# EAGLE design motor_ctrl_pw_v3 (EAGLE 6.5.0)
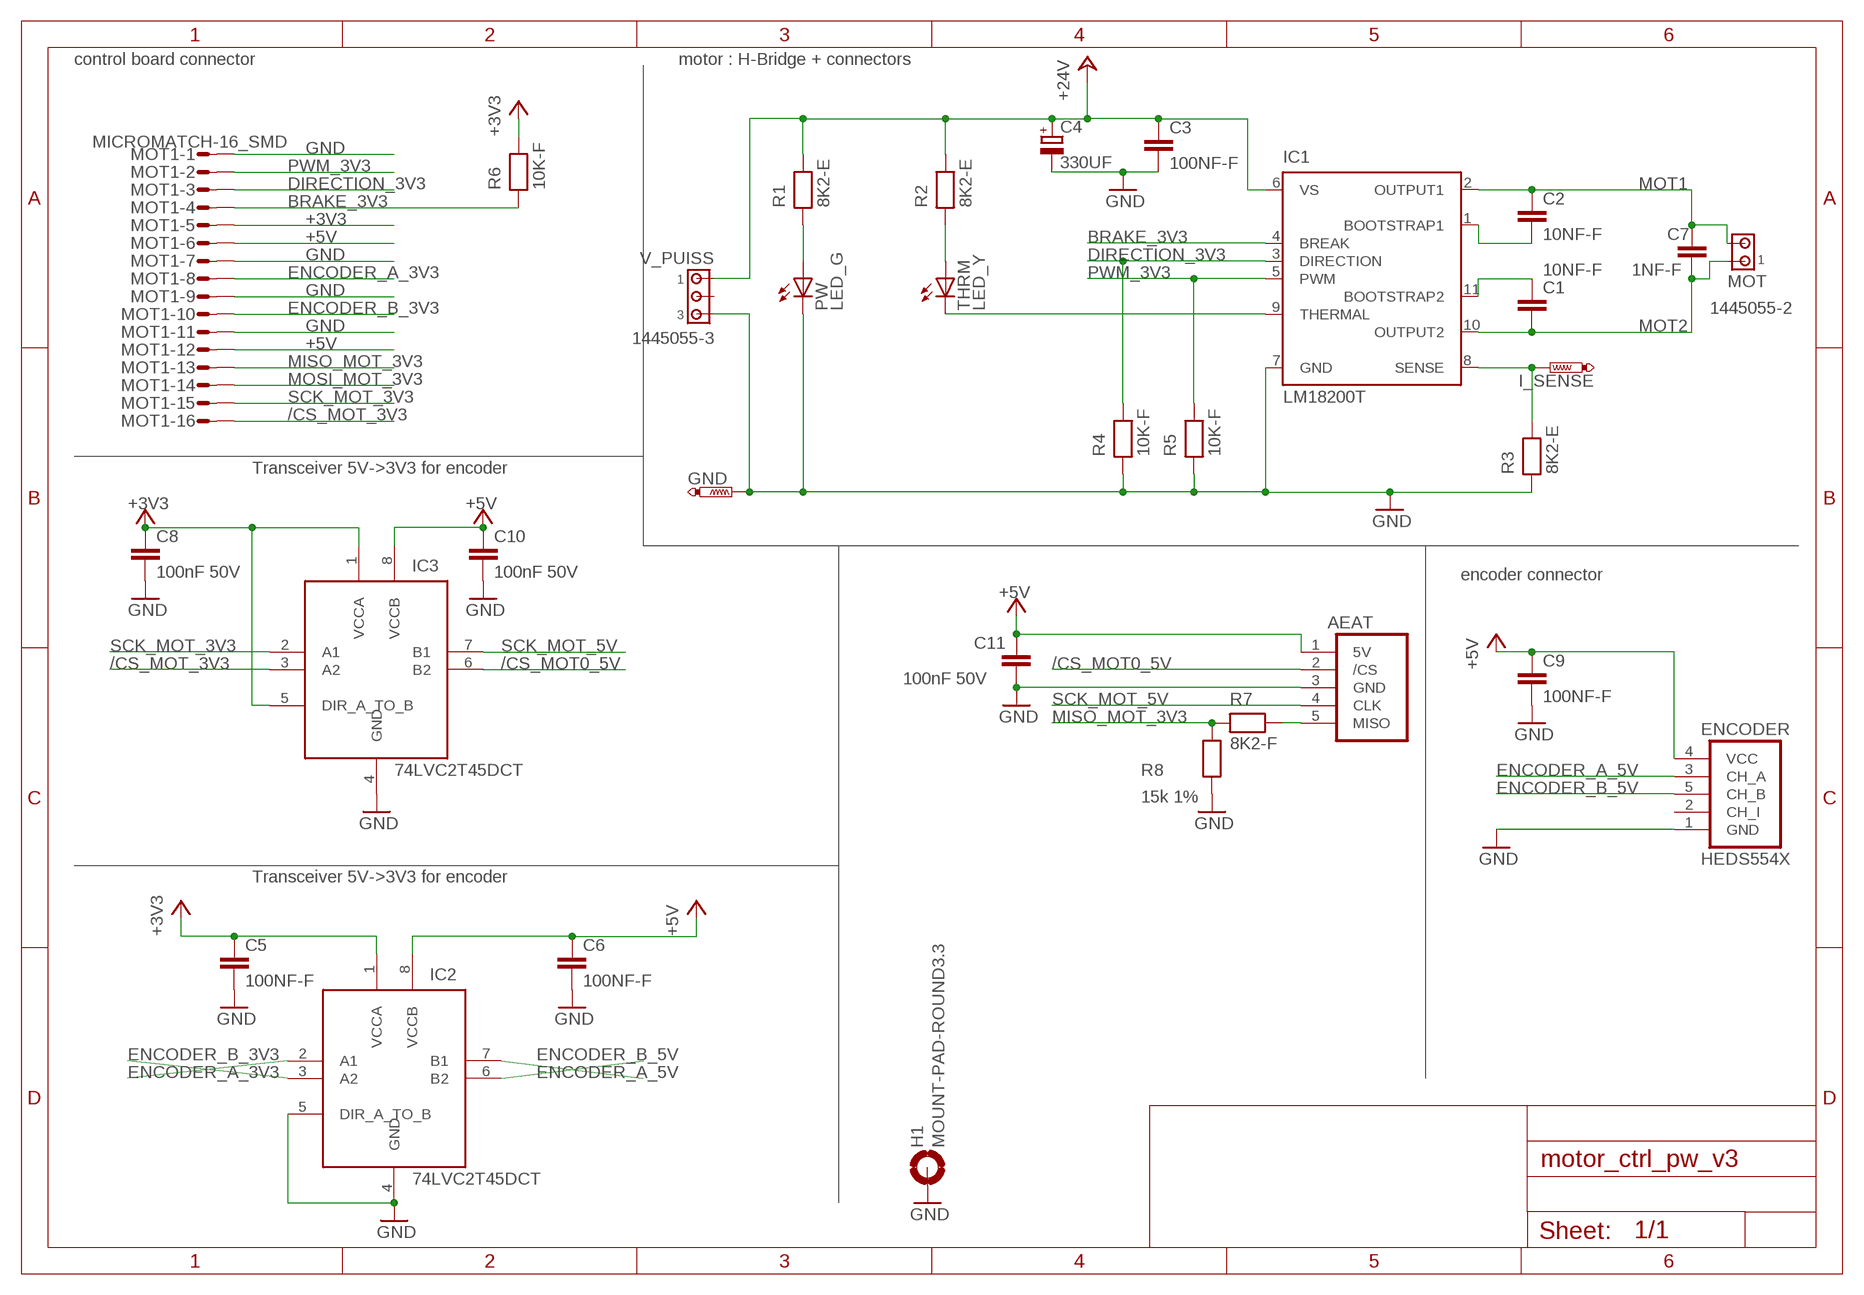
[diagram p0: schematic, sheet 1]

## Parts
AEAT  AEAT-601X  [53047-05]
C1  10NF-F  [C0603]
C2  10NF-F  [C0603]
C3  100NF-F  [C0603]
C4  330UF  [PANASONIC_G]
C5  100NF-F  [C0603]
C6  100NF-F  [C0603]
C7  1NF-F  [C0603]
C8  100nF 50V  100NF-F  [C0603]
C9  100NF-F  [C0603]
C10  100nF 50V  100NF-F  [C0603]
C11  100nF 50V  100NF-F  [C0603]
ENCODER  HEDS554X  [22-05-1052]
GND  PTR1PAD1-13  [P1-13]
H1  MOUNT-PAD-ROUND3.3  [3,3-PAD]
I_SENSE  PTR1PAD1-13  [P1-13]
IC1  LM18200T  [TO-220-11]
IC2  74LVC2T45DCT  [SSOP8]
IC3  74LVC2T45DCT  [SSOP8]
MOT  1445055-2  [1445055-2]
MOT1  MICROMATCH-16_SMD  [MICROMATCH-16_SMD]
PW  LED_G  [CHIP-LED0805]
R1  8K2-E  [R0805]
R2  8K2-E  [R0805]
R3  8K2-E  [R0805]
R4  10K-F  [R0603]
R5  10K-F  [R0603]
R6  10K-F  [R0603]
R7  8K2-F  [R0603]
R8  15k 1%  15K-F  [R0603]
THRM  LED_Y  [CHIP-LED0805]
V_PUISS  1445055-3  [1445055-3]

## Nets
+3V3: C5.1 C8.1 IC2.1(VCCA) IC3.1(VCCA) IC3.5(DIR_A_TO_B) MOT1.5 R6.2
+5V: AEAT.1(5V) C6.1 C9.1 C10.1 C11.1 ENCODER.4(VCC) IC2.8(VCCB) IC3.8(VCCB) MOT1.6 MOT1.12
+24V: C3.1 C4.+ IC1.6(VS) R1.2 R2.2 V_PUISS.1
/CS_MOT0_5V: AEAT.2(/CS) IC3.6(B2)
/CS_MOT_3V3: IC3.3(A2) MOT1.16
BRAKE_3V3: IC1.4(BREAK) MOT1.4 R6.1
DIRECTION_3V3: IC1.3(DIRECTION) MOT1.3 R4.2
ENCODER_A_3V3: IC2.2(A1) MOT1.8
ENCODER_A_5V: ENCODER.3(CH_A) IC2.7(B1)
ENCODER_B_3V3: IC2.3(A2) MOT1.10
ENCODER_B_5V: ENCODER.5(CH_B) IC2.6(B2)
GND: AEAT.3(GND) C3.2 C4.- C5.2 C6.2 C8.2 C9.2 C10.2 C11.2 ENCODER.1(GND) GND.TP H1.B3,3(MOUNT) IC1.7(GND) IC2.4(GND) IC2.5(DIR_A_TO_B) IC3.4(GND) MOT1.1 MOT1.7 MOT1.9 MOT1.11 PW.C R3.1 R4.1 R5.1 R8.1 V_PUISS.3
MISO_MOT_3V3: MOT1.13 R7.1 R8.2
MOSI_MOT_3V3: MOT1.14
MOT1: C2.1 C7.1 IC1.2(OUTPUT1) MOT.2
MOT2: C1.2 C7.2 IC1.10(OUTPUT2) MOT.1
N$1: R2.1 THRM.A
N$2: I_SENSE.TP IC1.8(SENSE) R3.2
N$3: PW.A R1.1
N$4: IC1.9(THERMAL) THRM.C
N$5: C2.2 IC1.1(BOOTSTRAP1)
N$6: C1.1 IC1.11(BOOTSTRAP2)
N$7: AEAT.5(MISO) R7.2
PWM_3V3: IC1.5(PWM) MOT1.2 R5.2
SCK_MOT_3V3: IC3.2(A1) MOT1.15
SCK_MOT_5V: AEAT.4(CLK) IC3.7(B1)
Unconnected: ENCODER.2(CH_I) V_PUISS.2

## Notes on the sheet
- control board connector | motor : H-Bridge + connectors
- Transceiver 5V->3V3 for encoder
- encoder connector
- Transceiver 5V->3V3 for encoder

## Library data of the parts
AEAT = robotter_connector:AEAT-601X
C1 C2 = robotter_capacitor:10NF; MOUSER: 81-GCM188R71H103KA7D; RS: 723-4982; VALUE: 10nF 50V
C3 C5 C6 C9 = robotter_capacitor:100NF; MOUSER: 81-GRM188F51H104ZA01; RS: 723-5534; VALUE: 100nF 50V
C4 = robotter_capacitor:330UF; MANUFACTURER: EEEFK1V331P; MOUSER: 667-EEE-FK1V331P; RS: 708-3475; VALUE: 330µF 35V
C7 = robotter_capacitor:1NF
C8 C10 C11 = robotter_capacitor:100NF; MOUSER: 81-GRM188F51H104ZA01; RS: 723-5534
ENCODER = robotter_connector:HEDS554X; FARNELL: 9732594; MOUSER: 538-22-05-1052; RS: 687-7275; VALUE: 22-05-1052
GND I_SENSE = testpad:PTR1: TEST PIN
H1 = holes:MOUNT-PAD-ROUND: MOUNTING PAD, round
IC1 = robotter_ic:LM18200T: 3A, 55V H-Bridge Motor Control SourcE: http://cache.national.com/ds/LM/LMD18200.pdf; FARNELL: 1468979; MOUSER: 926-LMD18200T/NOPB; RS: 534-4276
IC2 IC3 = robotter_ic:74LVC2T45DCT
MOT = robotter_connector:1445055-2: Micro MATE-N-LOK Connectors grid 1.5 mm Source: ENG_CD_1445055_A.pdf; MOUSER: 571-2-1445055-2; RS: 495-9580
MOT1 = robotter_connector:MICROMATCH-16_SMD: MicroMaTch 16 FN : 1565592 / 8-215464-6 / 1-215464-6 Drawing Number C-215464 DDEController.pdf; MOUSER: 571-8-188275-6; RS: 739-1237
PW = robotter_diode:LED_; MOUSER: 859-LTST-C171GKT; RS: 692-0935; VALUE: GREEN
R1-R3 = robotter_resistor:8K2; MOUSER: 71-CRCW08058K20FKEB; RS: 679-1727
R4-R6 = robotter_resistor:10K; MOUSER: 652-CR0603-JW-103ELF; RS: 740-8899
R7 = robotter_resistor:8K2; MOUSER: 71-CRCW0603-8.2K-E3; RS: 679-0759
R8 = robotter_resistor:15K; MOUSER: 652-CR0603-JW-153GLF; RS: 740-8912
THRM = robotter_diode:LED_; MOUSER: 859-LTST-C170YKT; RS: 692-0925; VALUE: YELLOW
V_PUISS = robotter_connector:1445055-3: Micro MATE-N-LOK Connectors grid 1.5 mm Source: ENG_CD_1445055_A.pdf; FARNELL: 1111119; MOUSER: 571-2-1445055-3; RS: 495-9596

## Board
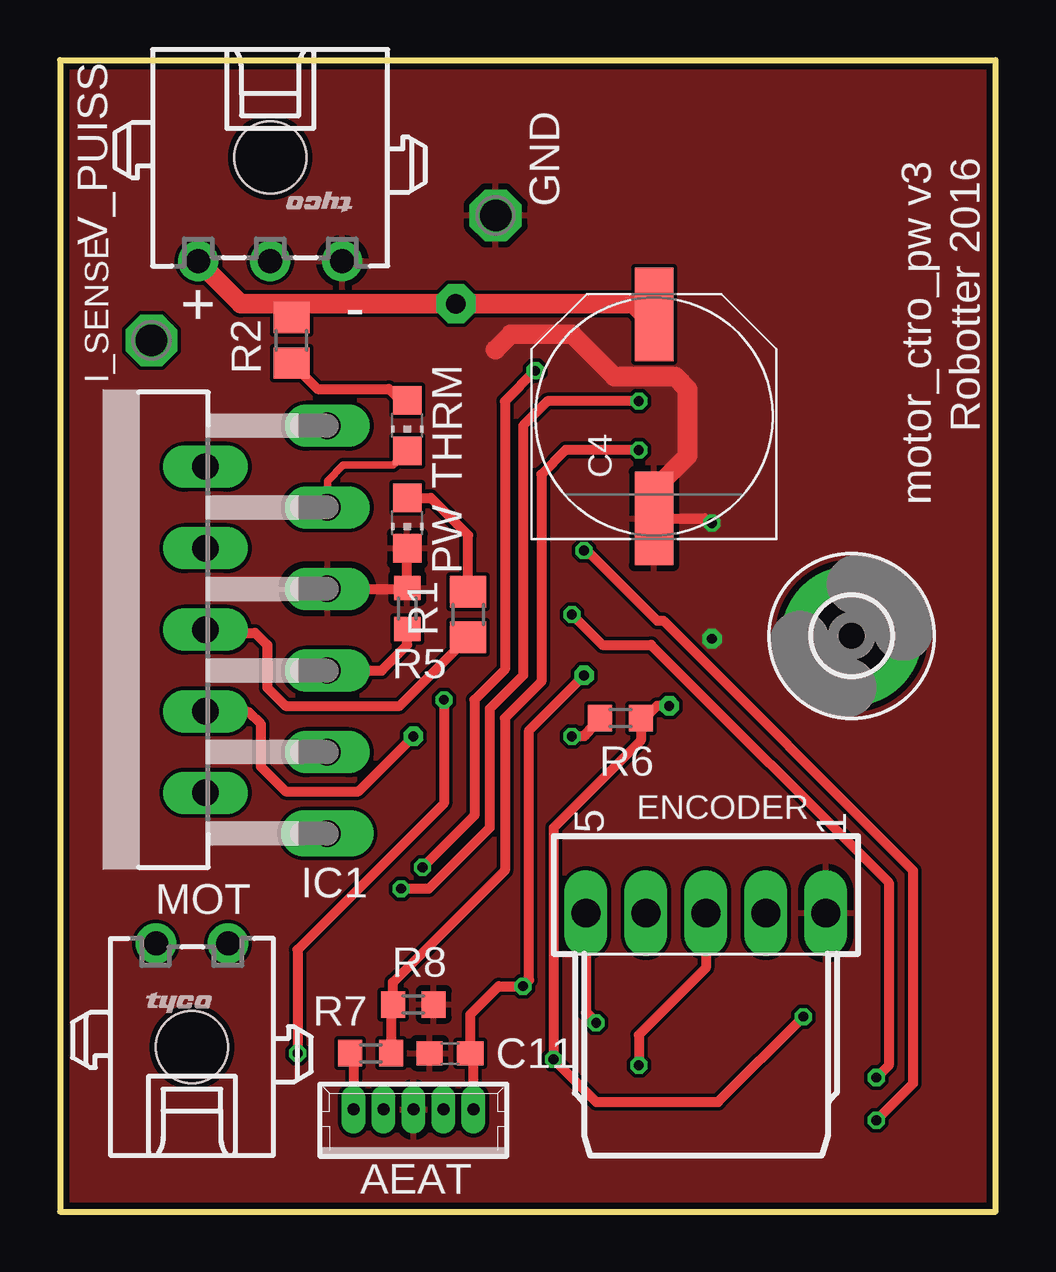
[diagram p1: board, top side]
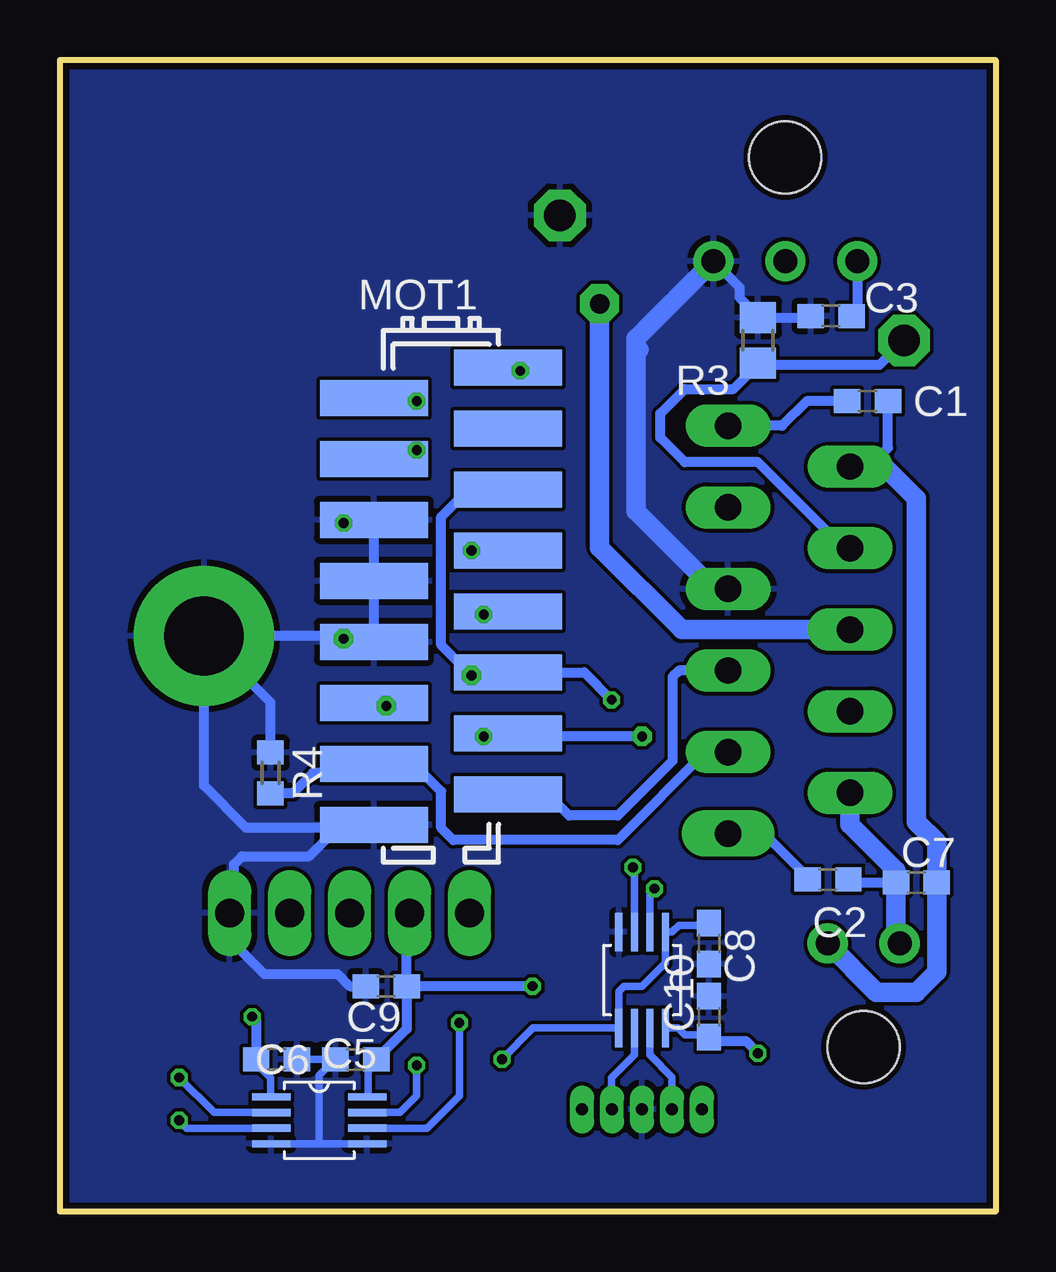
[diagram p2: board, bottom side, seen from below]

Size 39 x 48.01 mm. Coordinates in mm from the lower left corner, seen from the top.
Outline: 0,48 39,48 39,0 0,0 0,48.01
Copper layers (1*16): Top 0.035mm / dielectric 1.5mm / Bottom 0.035mm
Design rules "Fusion_eagle_rule_v1.1": minimum track width 6mil, minimum drill 12mil, track to track 6mil, track to pad 6mil, pad to pad 6mil, via to via 6mil, smd to smd 0mil, copper to edge 10mil, drill to drill 10mil, minimum pad ring 10mil, minimum via ring 6mil, stop-mask expansion 2mil, vias tented up to drill 100mil, thermal gap 10mil

### Footprints (pad centres in the part's own frame; a part is rotated, then mirrored left to right if it is on the bottom)
53047-05 = drill 0.5 pad 0.698 long: 1 2.5,0.45; 2 1.25,0.45; 3 0,0.45; 4 -1.25,0.45; 5 -2.5,0.45
C0603 = smd 1.1 x 1: 1 -0.85,0; 2 0.85,0
PANASONIC_G = smd 3.9 x 1.6: + 4.25,0; - -4.25,0
22-05-1052 = drill 1.2 long: 1 5,0; 2 2.5,0; 3 0,0; 4 -2.5,0; 5 -5,0
P1-13 = drill 1.321 pad 2.159 octagon: TP 0,0
3,3-PAD = drill 3.3 pad 5.842: B3,3 0,0
TO-220-11 = drill 1.1 pad 1.93 long: 1 -8.5,-9.37 | drill 1.1 pad 1.778 long: 2 -6.8,-4.29; 3 -5.1,-9.37; 4 -3.4,-4.29; 5 -1.7,-9.37; 6 0,-4.29; 7 1.7,-9.37; 8 3.4,-4.29; 9 5.1,-9.37; 10 6.8,-4.29; 11 8.5,-9.37
SSOP8 = smd 0.3 x 1.6: 1 -0.975,-2; 2 -0.325,-2; 3 0.325,-2; 4 0.975,-2; 5 0.975,2; 6 0.325,2; 7 -0.325,2; 8 -0.975,2
1445055-2 = drill 1 pad 1.676: 1 1.5,4.32; 2 -1.5,4.32 | hole 3: 0,0
MICROMATCH-16_SMD = smd 1.5 x 4.5: 1 9.525,-2.794; 2 8.255,2.794; 3 6.985,-2.794; 4 5.715,2.794; 5 4.445,-2.794; 6 3.175,2.794; 7 1.905,-2.794; 8 0.635,2.794; 9 -0.635,-2.794; 10 -1.905,2.794; 11 -3.175,-2.794; 12 -4.445,2.794; 13 -5.715,-2.794; 14 -6.985,2.794; 15 -8.255,-2.794; 16 -9.525,2.794
CHIP-LED0805 = smd 1.2 x 1.2: A 0,-1.05; C 0,1.05
R0805 = smd 1.3 x 1.5: 1 -0.95,0; 2 0.95,0
R0603 = smd 1 x 1.1: 1 -0.85,0; 2 0.85,0
1445055-3 = drill 1 pad 1.676: 1 3,4.32; 2 0,4.32; 3 -3,4.32 | hole 3: 0,0

### Placement (x,y rotation side)
AEAT  14.73,3.81 0 top
C1  5.33,33.78 0 bottom
C2  6.99,13.84 180 bottom
C3  6.86,37.34 180 bottom
C4  24.77,33.15 90 top
C5  29.97,6.35 0 bottom
C6  26.67,6.35 180 bottom
C7  3.3,13.72 0 bottom
C8  11.94,11.18 270 bottom
C9  25.4,9.4 180 bottom
C10  11.94,8.13 90 bottom
C11  16.26,6.6 180 top
ENCODER  26.92,12.45 0 top
GND  18.16,41.53 0 top
H1  33,24 0 top
I_SENSE  3.81,36.32 0 top
IC1  1.78,24.26 90 top
IC2  28.19,3.81 270 bottom
IC3  14.73,9.65 180 bottom
MOT  5.5,6.86 0 top
MOT1  23.11,25.65 270 bottom
PW  14.48,28.7 180 top
R1  17.02,24.89 270 top
R2  9.65,36.32 90 top
R3  9.91,36.32 270 bottom
R4  30.23,18.29 270 bottom
R5  14.48,25.15 270 top
R6  23.37,20.57 0 top
R7  12.95,6.6 180 top
R8  14.73,8.64 180 top
THRM  14.48,32.77 180 top
V_PUISS  8.76,43.94 180 top

### Tracks (layer width: path | path; a pad name or v marks a point on that pad's centre or on a via)
+3V3  (via drill 0.41, 0.41 pad 0.81)
  Top 0.406: v25.4,21.08 24.89,21.08 24.38,20.57 R6.2 24.22,19.65 20.57,16 v20.57,6.35 22.35,4.57 27.43,4.57 v30.99,8.13
  Bottom 0.305: IC2.1 30.23,4.82 30.23,5.59 30.82,6.18 C5.1 | C8.1 12.03,11.94 13.21,11.94 13.49,11.65 IC3.1 13.76,10.37 14.73,9.4 15.49,9.4 15.71,9.19 IC3.5 19.27,7.65 v20.57,6.35
  Bottom 0.406: v25.4,21.08 26.04,21.08 MOT1.5 | 11.85,11.94 C8.1 | v30.99,8.13 30.82,7.96 C5.1
+5V  (via drill 0.41, 0.41 pad 0.81)
  Top 0.406: v21.84,22.35 19.56,20.07 19.56,9.65 v19.3,9.4 18.29,9.4 17.11,8.22 C11.1 17.23,6.48 AEAT.1 | v16,21.34 16,17.02 9.91,10.92 v9.91,6.6
  Bottom 0.305: IC2.8 26.16,4.82 26.16,5.84 25.65,6.35 C6.1 | IC3.8 13.24,7.65 12.95,7.37 12.03,7.37 C10.1
  Bottom 0.406: MOT1.12 21.97,30.1 23.11,28.96 23.11,23.62 21.97,22.48 MOT1.6 | C9.1 24.55,12.32 ENCODER.4 | v19.3,9.4 C9.1 | C9.1 24.55,7.62 C6.1 | MOT1.6 17.14,22.48 v16,21.34 | C10.1 11.77,7.11 10.41,7.11 v9.91,6.6 | MOT1.6 20.45,22.35 v21.84,22.35
+24V  (via drill 0.81 pad 1.63)
  Top 0.406: v16.51,37.85 16.26,38.1 | IC1.6 6.2,24.13 8.13,24.13 8.64,23.62 8.64,21.84 9.4,21.08 14.16,21.08 R1.2 | 9.91,37.34 9.91,37.59 9.65,37.85 | 10.16,37.85 10.16,37.78 R2.2
  Top 0.813: 9.53,37.85 9.65,37.85 10.16,37.85 v16.51,37.85 23.88,37.85 24.26,37.47 C4.+ | 9.53,37.85 7.54,37.85 V_PUISS.1 | 9.91,37.34 9.91,37.47 9.53,37.85
  Bottom 0.406: V_PUISS.1 5.76,37.58 C3.1
  Bottom 0.813: IC1.6 13.08,24.26 16.51,27.69 v16.51,37.85
/CS_MOT0_5V
  Bottom 0.305: IC3.6 15.06,6.53 16,5.59 16,4.28 AEAT.2
/CS_MOT_3V3  (via drill 0.41)
  Top 0.406: v19.81,35.05 18.54,33.78 18.54,22.61 17.27,21.34 17.27,16.51 v15.11,14.35
  Bottom 0.305: IC3.3 15.06,14.28 v15.11,14.35
  Bottom 0.406: MOT1.16 19.94,35.18 v19.81,35.05
BRAKE_3V3  (via drill 0.41, 0.41 pad 0.81)
  Top 0.406: IC1.4 6.1,20.83 7.87,20.83 8.38,20.32 8.38,18.54 9.4,17.53 12.45,17.53 v14.73,19.81 | R6.1 21.84,19.81 v21.34,19.81
  Bottom 0.406: v14.73,19.81 v21.34,19.81 MOT1.4
DIRECTION_3V3
  Bottom 0.406: IC1.3 12.09,19.16 15.75,15.49 22.61,15.49 23.11,16 23.11,17.53 24.26,18.67 MOT1.3 26.54,18.67 26.92,18.29 28.45,18.29 29.3,17.44 R4.2
ENCODER_A_3V3  (via drill 0.41)
  Top 0.406: v21.34,24.89 22.61,23.62 24.64,23.62 34.54,13.72 34.54,6.1 v34.04,5.59
  Bottom 0.305: IC2.2 32.58,4.13 v34.04,5.59
  Bottom 0.406: MOT1.8 20.19,24.89 v21.34,24.89
ENCODER_A_5V  (via drill 0.41)
  Top 0.406: ENCODER.3 26.92,10.16 24.13,7.37 v24.13,6.1
  Bottom 0.305: IC2.7 24.82,4.13 24.13,4.83 v24.13,6.1
ENCODER_B_3V3  (via drill 0.41)
  Top 0.406: v34.04,3.81 35.56,5.33 35.56,14.22 25.15,24.64 24.89,24.64 21.84,27.69 v21.84,27.56
  Bottom 0.305: v34.04,3.81 33.71,3.48 IC2.3
  Bottom 0.406: 19.3,27.43 19.43,27.56 MOT1.10 v21.84,27.56
ENCODER_B_5V  (via drill 0.41)
  Top 0.406: ENCODER.5 21.92,8.3 v22.35,7.87
  Bottom 0.305: IC2.6 23.69,3.48 22.35,4.83 v22.35,7.87
GND  (via drill 0.41, 0.41 pad 0.81)
  Top 0.406: IC1.7 14.31,25.96 14.35,26 R5.1 PW.C | C4.- 26.86,28.9 v27.18,28.7
  Top 0.813: 18.16,35.94 18.8,36.58 21.34,36.58 23.11,34.8 25.65,34.8 26.16,34.29 26.16,31.5 24.77,30.1 C4.-
  Bottom 0.305: IC2.5 28.19,2.83 | 28.19,2.83 IC2.4 | 28.19,2.83 28.19,5.68 C6.2 C5.2
  Bottom 0.406: 11.68,39.62 V_PUISS.3 10.67,38.53 10.67,38.1 9.91,37.34 R3.1 7.77,37.27 C3.2 | C9.2 26.92,9.4 27.43,9.91 30.48,9.91 31.92,11.35 ENCODER.1 31.75,12.62 31.75,14.48 31.42,14.81 28.62,14.81 27.43,16 | 27.43,16 25.91,16 MOT1.1 | 27.43,16 31.24,16 33,17.76 H1.B3,3 | H1.B3,3 27.3,24 v27.18,23.88 25.53,23.37 MOT1.7 MOT1.9 MOT1.11 26.04,28.7 v27.18,28.7 | R4.1 30.23,21.23 H1.B3,3
  Bottom 0.813: IC1.7 11.73,25.96 14.99,29.21 14.99,36.07 | 14.99,36.07 14.99,36.4 V_PUISS.3 | 14.86,35.94 14.99,36.07
  pour Top: 0,48.01 0,0 38.86,0 38.86,48.01
  pour Bottom: 0,0 38.86,0 38.86,48.01 0,48.01
MISO_MOT_3V3  (via drill 0.41)
  Top 0.406: R7.1 13.8,8.64 R8.2 13.88,9.56 18.54,14.22 18.54,20.57 20.07,22.1 20.07,30.73 21.08,31.75 v24.13,31.75
  Bottom 0.406: MOT1.13 26.29,31.37 v24.13,31.75
MOT1
  Bottom 0.406: C2.1 5.75,13.72 C7.1
  Bottom 0.813: IC1.2 6.07,16.14 4.15,14.22 C7.1 4.15,11.33 MOT.2
MOT2
  Bottom 0.406: C1.2 4.48,31.84 5.26,31.06 IC1.10
  Bottom 0.813: IC1.10 4.64,31.06 3.3,29.72 3.3,16.26 2.45,15.41 C7.2 2.45,9.99 3.3,9.14 4.97,9.14 MOT.1
N$1
  Top 0.406: R2.1 10.73,34.29 13.72,34.29 14.19,33.82 THRM.A
N$2
  Bottom 0.406: IC1.8 6.32,27.66 9.91,31.24 12.95,31.24 13.97,32.26 13.97,33.27 12.95,34.29 10.92,34.29 9.91,35.31 | I_SENSE.TP 4.83,35.31 9.91,35.31 | 9.46,35.37 R3.2 9.91,35.31
N$3
  Top 0.406: PW.A 15.46,29.75 17.02,28.19 R1.1
N$4
  Top 0.305: THRM.C 13.88,31.11 11.81,31.11 11.15,30.45 IC1.9
N$5
  Bottom 0.406: C2.2 7.71,13.97 7.87,13.97 9.66,15.76 IC1.1
N$6
  Bottom 0.406: IC1.11 8.9,32.76 7.87,33.78 C1.1
N$7
  Top 0.406: R7.2 12.23,6.48 AEAT.5
PWM_3V3
  Top 0.406: R5.2 14.48,23.62 13.41,22.56 IC1.5
  Bottom 0.406: IC1.5 13.21,22.56 13.46,22.3 13.46,18.8 15.75,16.51 17.78,16.51 18.41,17.14 MOT1.2
SCK_MOT_3V3  (via drill 0.41)
  Top 0.406: v24.13,33.78 20.32,33.78 19.3,32.77 19.3,22.35 17.91,20.95 17.91,16 15.37,13.46 v14.22,13.46
  Bottom 0.305: IC3.2 14.41,13.28 v14.22,13.46
  Bottom 0.406: MOT1.15 26.04,33.78 v24.13,33.78
SCK_MOT_5V
  Bottom 0.305: IC3.7 14.41,6.53 13.48,5.61 AEAT.4

### Text on the board
tNames: - | + | Robotter 2016 | motor_ctro_pw v3